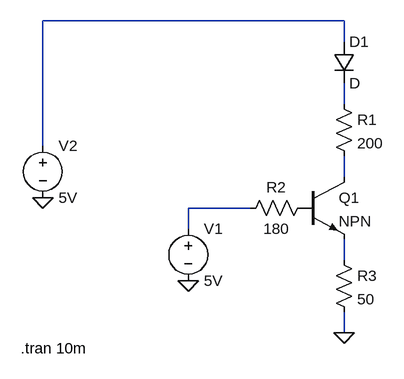
[diagram p0: schematic Test.asc]
Test.asc, the LTspice schematic file:
Version 4
SHEET 1 880 680
WIRE 224 64 -240 64
WIRE 224 96 224 64
WIRE 224 192 224 160
WIRE -240 256 -240 64
WIRE 224 304 224 272
WIRE 80 352 -16 352
WIRE -16 384 -16 352
WIRE 224 432 224 400
WIRE 224 544 224 512
FLAG -16 464 0
FLAG 224 544 0
FLAG -240 336 0
SYMBOL diode 208 96 R0
SYMATTR InstName D1
SYMBOL npn 160 304 R0
SYMATTR InstName Q1
SYMBOL res 208 176 R0
SYMATTR InstName R1
SYMATTR Value 200
SYMBOL voltage -16 368 R0
SYMATTR InstName V1
SYMATTR Value 5V
SYMBOL res 176 336 R90
WINDOW 0 0 56 VBottom 2
WINDOW 3 32 56 VTop 2
SYMATTR InstName R2
SYMATTR Value 180
SYMBOL res 208 416 R0
SYMATTR InstName R3
SYMATTR Value 50
SYMBOL voltage -240 240 R0
SYMATTR InstName V2
SYMATTR Value 5V
TEXT -274 568 Left 2 !.tran 10m

The netlist it stands for:
* Test.asc
D1 N001 N002 D
Q1 N003 P001 N005 0 NPN
R1 N002 N003 200
V1 N004 0 5V
R2 P001 N004 180
R3 N005 0 50
V2 N001 0 5V
.model D D
.lib standard.dio
.model NPN NPN
.model PNP PNP
.lib standard.bjt
.tran 10m
.backanno
.end